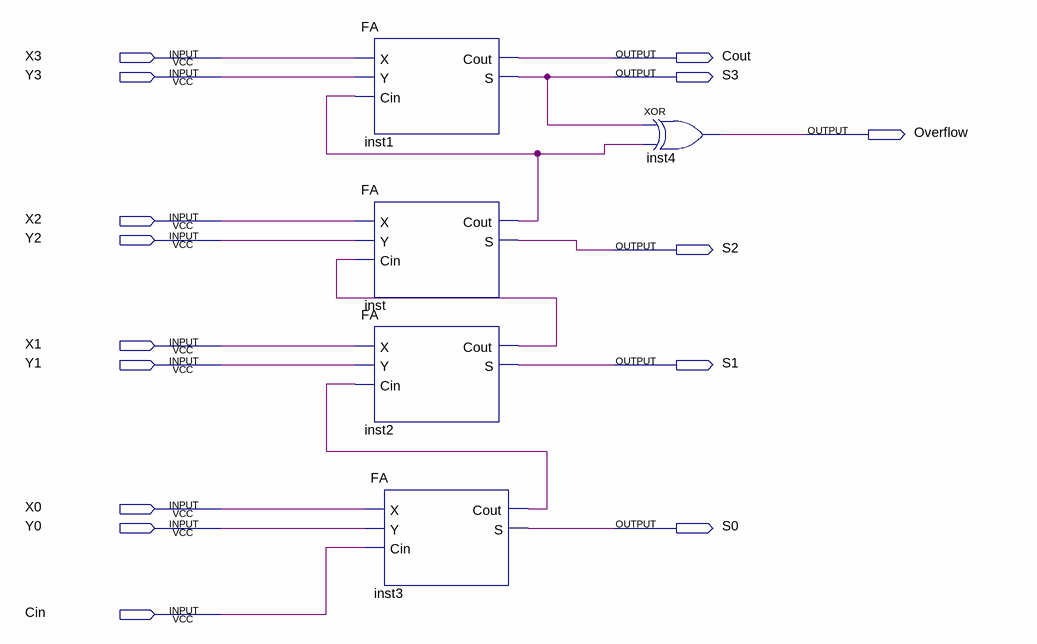
[diagram p0: schematic sheet]
// Quartus schematic 4bitRipple.bdf as structural Verilog: 5 symbols, 15 pins
module \4bitRipple  (
  input  X3,
  input  Y3,
  input  X2,
  input  Y2,
  input  X1,
  input  Y1,
  input  X0,
  input  Y0,
  input  Cin,
  output Cout,
  output S3,
  output Overflow,
  output S2,
  output S1,
  output S0
);

  wire inst2_cout, inst3_cout, inst_cout;

  FA inst1 (.X(X3), .Y(Y3), .Cin(inst_cout), .Cout(Cout), .S(S3));
  FA inst (.X(X2), .Y(Y2), .Cin(inst2_cout), .Cout(inst_cout), .S(S2));
  FA inst2 (.X(X1), .Y(Y1), .Cin(inst3_cout), .Cout(inst2_cout), .S(S1));
  FA inst3 (.X(X0), .Y(Y0), .Cin(Cin), .Cout(inst3_cout), .S(S0));
  xor inst4 (Overflow, S3, inst_cout);
endmodule
